# EAGLE design basecircuit (EAGLE 6.2)
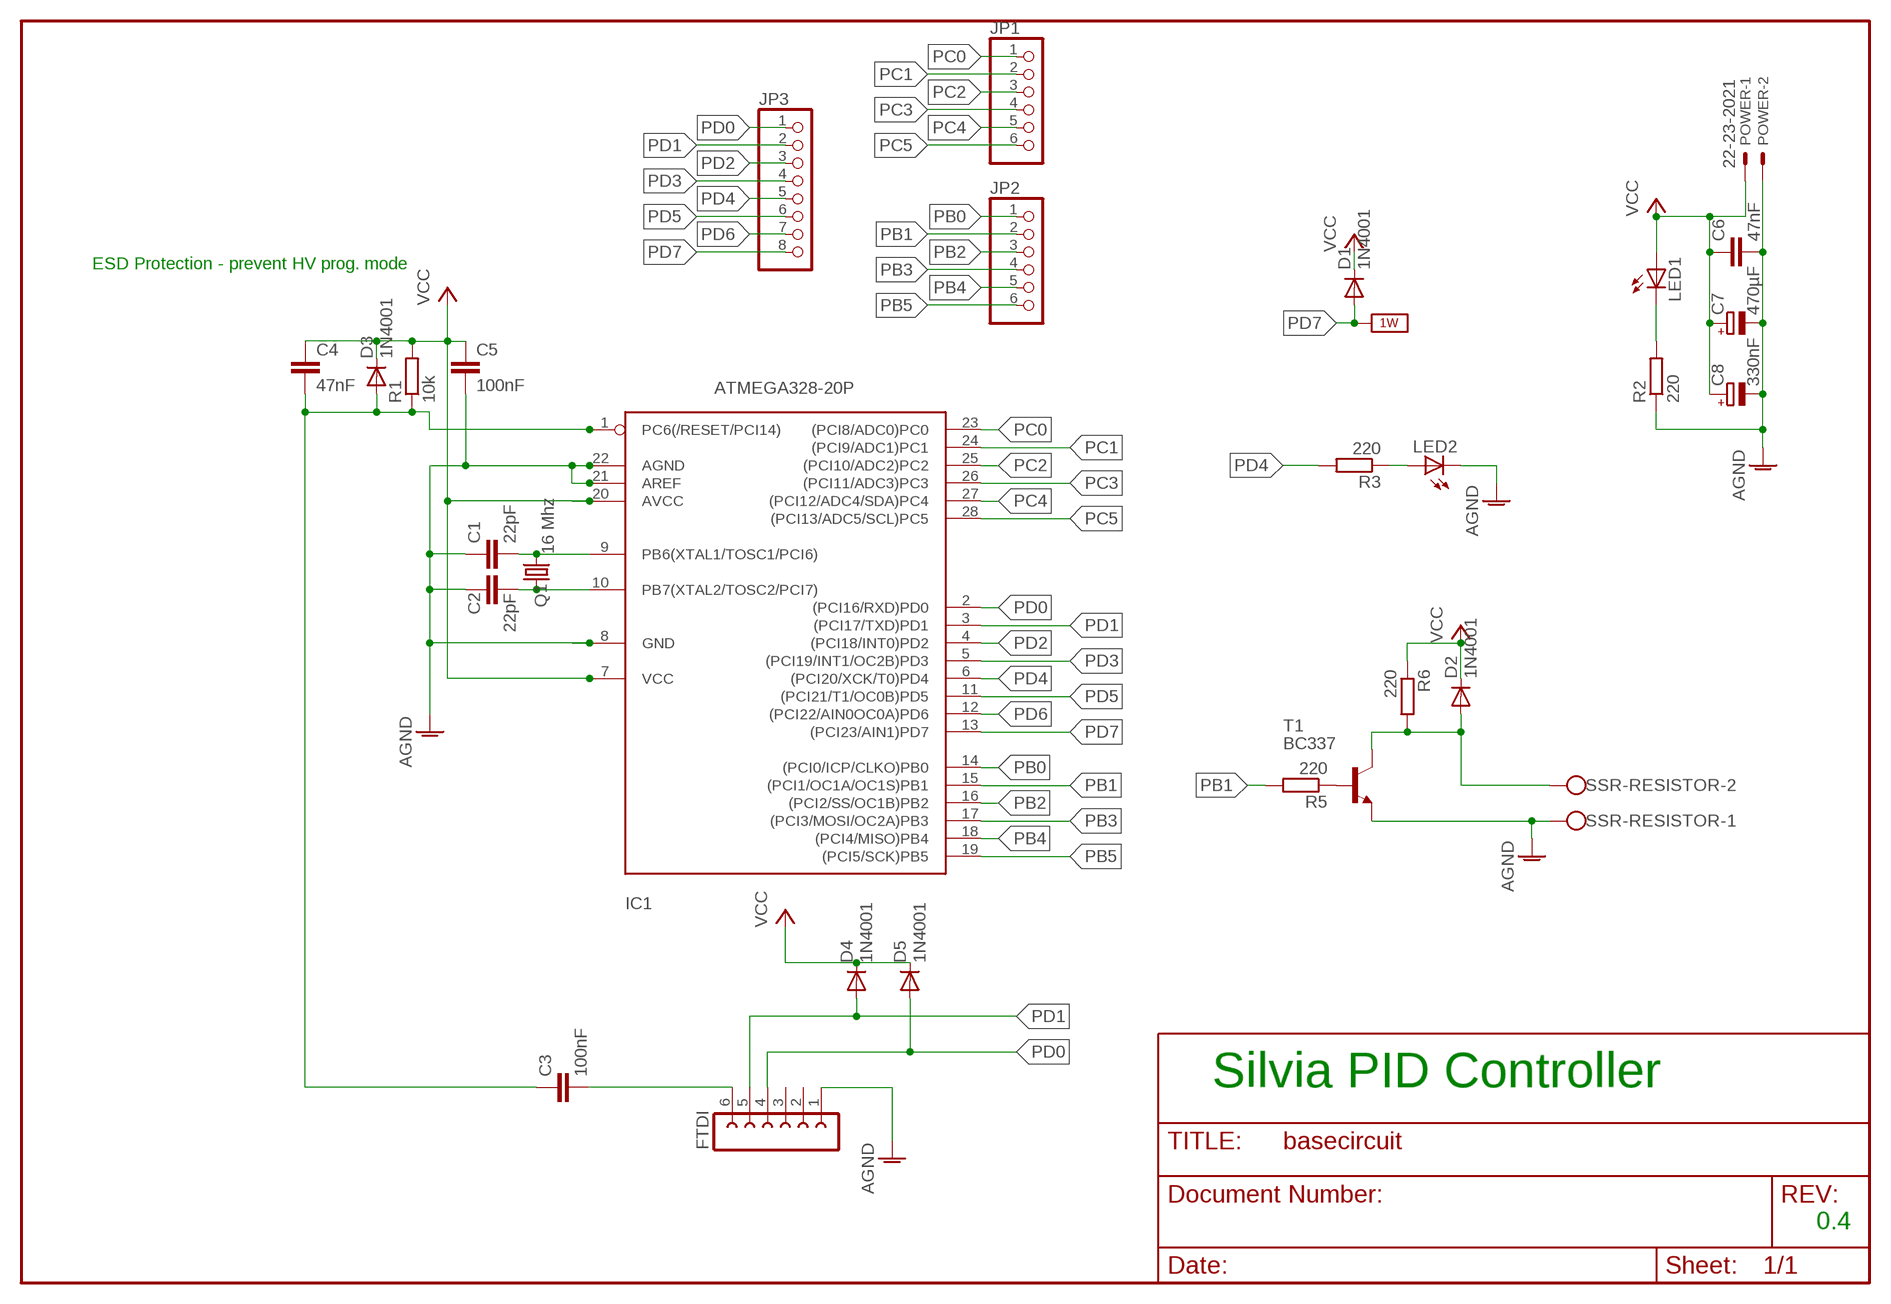
[diagram p0: schematic, sheet 1]

## Parts
C1  22pF  C-EU025-030X050  [C025-030X050]
C2  22pF  C-EU025-030X050  [C025-030X050]
C3  100nF  C-EU025-030X050  [C025-030X050]
C4  47nF  C-EU025-030X050  [C025-030X050]
C5  100nF  C-EU025-025X050  [C025-025X050]
C6  47nF  C-EU025-030X050  [C025-030X050]
C7  470µF  CPOL-EUE2,5-6E  [E2,5-6E]
C8  330nF  CPOL-EUE2,5-6E  [E2,5-6E]
D1  1N4001  1N4004  [DO41-10]
D2  1N4001  1N4004  [DO41-10]
D3  1N4001  1N4004  [DO41-10]
D4  1N4001  1N4004  [DO41-10]
D5  1N4001  1N4004  [DO41-10]
FTDI  FE06-1  [FE06]
IC1  ATMEGA328-20P  ATMEGA168-20P  [DIL28-3]
JP1  PINHD-1X6  [1X06]
JP2  PINHD-1X6  [1X06]
JP3  PINHD-1X8  [1X08]
LED1  LED5MM  [LED5MM]
LED2  LED5MM  [LED5MM]
POWER  22-23-2021  [22-23-2021]
Q1  16 Mhz  CRYSTALHC49U-V  [HC49U-V]
R1  10k  R-EU_0204/7  [0204/7]
R2  220  R-EU_0204/7  [0204/7]
R3  220  R-EU_0204/7  [0204/7]
R5  220  R-EU_0204/7  [0204/7]
R6  220  R-EU_0204/7  [0204/7]
SSR-RESISTOR  W237-102  [W237-102]
T1  BC337  [TO92]

## Nets
AGND: C1.1 C2.1 C5.2 C6.2 C7.- C8.- FTDI.1 IC1.8(GND) IC1.21(AREF) IC1.22(AGND) LED2.K(C) POWER.2 R2.1 SSR-RESISTOR.1 T1.1(E)
N$1: R5.1 T1.2(B)
N$2: LED1.K(C) R2.2
N$3: C3.2 FTDI.6
N$6: LED2.A R3.1
N$9: C1.2 IC1.9(PB6(XTAL1/TOSC1/PCI6)) Q1.2
N$10: C2.2 IC1.10(PB7(XTAL2/TOSC2/PCI7)) Q1.1
N$11: C3.1 C4.2 D3.A IC1.1(PC6(/RESET/PCI14)) R1.1
N$14: D2.A R6.2 SSR-RESISTOR.2 T1.3(C)
PB0: IC1.14((PCI0/ICP/CLKO)PB0) JP2.1
PB1: IC1.15((PCI1/OC1A/OC1S)PB1) JP2.2 R5.2
PB2: IC1.16((PCI2/SS/OC1B)PB2) JP2.3
PB3: IC1.17((PCI3/MOSI/OC2A)PB3) JP2.4
PB4: IC1.18((PCI4/MISO)PB4) JP2.5
PB5: IC1.19((PCI5/SCK)PB5) JP2.6
PC0: IC1.23((PCI8/ADC0)PC0) JP1.1
PC1: IC1.24((PCI9/ADC1)PC1) JP1.2
PC2: IC1.25((PCI10/ADC2)PC2) JP1.3
PC3: IC1.26((PCI11/ADC3)PC3) JP1.4
PC4: IC1.27((PCI12/ADC4/SDA)PC4) JP1.5
PC5: IC1.28((PCI13/ADC5/SCL)PC5) JP1.6
PD0: D5.A FTDI.4 IC1.2((PCI16/RXD)PD0) JP3.1
PD1: D4.A FTDI.5 IC1.3((PCI17/TXD)PD1) JP3.2
PD2: IC1.4((PCI18/INT0)PD2) JP3.3
PD3: IC1.5((PCI19/INT1/OC2B)PD3) JP3.4
PD4: IC1.6((PCI20/XCK/T0)PD4) JP3.5 R3.2
PD5: IC1.11((PCI21/T1/OC0B)PD5) JP3.6
PD6: IC1.12((PCI22/AIN0OC0A)PD6) JP3.7
PD7: D1.A IC1.13((PCI23/AIN1)PD7) JP3.8 ; supply symbol labelled 1W_SUP
VCC: C4.1 C5.1 C6.1 C7.+ C8.+ D1.C D2.C D3.C D4.C D5.C IC1.7(VCC) IC1.20(AVCC) LED1.A POWER.1 R1.2 R6.1
Unconnected: FTDI.2 FTDI.3

## Notes on the sheet
- ESD Protection - prevent HV prog. mode
- Silvia PID Controller
- 0.4

## Library data of the parts
C1-C6 = rcl:C-EU: CAPACITOR, European symbol
C7 C8 = rcl:CPOL-EU: POLARIZED CAPACITOR, European symbol
D1-D5 = diode:1N4004: DIODE general purpose rectifier, 1 A
FTDI = con-lsta:FE06-1: FEMALE HEADER
IC1 = avr:ATMEGA168*P: MICROCONTROLLER 16 kBytes FLASH 1 kBytes SRAM 512 Bytes EEPROM USART 8-channel 10 bit ADC
JP1 JP2 = pinhead:PINHD-1X6: PIN HEADER
JP3 = pinhead:PINHD-1X8: PIN HEADER
LED1 LED2 = led:LED: LED OSRAM: - CHIPLED LG R971, LG N971, LY N971, LG Q971, LY Q971, LO R971, LY R971 LH N974, LH R974 LS Q976, LO Q976, LY Q976 LO Q996 - Hyper CHIPLED LW Q18S LB Q993, LB Q99A, LB R99A - SideLED LS A670, LO A670, LY A670, LG A670, LP A670 LB A673, LV A673, LT A673, LW A673 LH A674 LY A675 LS A676, LA A676, LO A676, LY A676, LW A676 LS A679, LY A679, LG A679 - Hyper Micro SIDELED® LS Y876, LA Y876, LO Y876, LY Y876 LT Y87S - SmartLED LW L88C, LW L88S LB L89C, LB L89S, LG L890 LS L89K, LO L89K, LY L89K LS L896, LA L896, LO L896, LY L896 - TOPLED LS T670, LO T670, LY T670, LG T670, LP T670 LSG T670, LSP T670, LSY T670, LOP T670, LYG T670 LG T671, LOG T671, LSG T671 LB T673, LV T673, LT T673, LW T673 LH T674 LS T676, LA T676, LO T676, LY T676, LB T676, LH T676, LSB T676, LW T676 LB T67C, LV T67C, LT T67C, LS T67K, LO T67K, LY T67K, LW E67C LS E67B, LA E67B, LO E67B, LY E67B, LB E67C, LV E67C, LT E67C LW T67C LS T679, LY T679, LG T679 LS T770, LO T770, LY T770, LG T770, LP T770 LB T773, LV T773, LT T773, LW T773 LH T774 LS E675, LA E675, LY E675, LS T675 LS T776, LA T776, LO T776, LY T776, LB T776 LHGB T686 LT T68C, LB T68C - Hyper Mini TOPLED® LB M676 - Mini TOPLED Santana® LG M470 LS M47K, LO M47K, LY M47K Source: http://www.osram.convergy.de LUXEON: - LUMILED® LXK2-PW12-R00, LXK2-PW12-S00, LXK2-PW14-U00, LXK2-PW14-V00 LXK2-PM12-R00, LXK2-PM12-S00, LXK2-PM14-U00 LXK2-PE12-Q00, LXK2-PE12-R00, LXK2-PE12-S00, LXK2-PE14-T00, LXK2-PE14-U00 LXK2-PB12-K00, LXK2-PB12-L00, LXK2-PB12-M00, LXK2-PB14-N00, LXK2-PB14-P00, LXK2-PB14-Q00 LXK2-PR12-L00, LXK2-PR12-M00, LXK2-PR14-Q00, LXK2-PR14-R00 LXK2-PD12-Q00, LXK2-PD12-R00, LXK2-PD12-S00 LXK2-PH12-R00, LXK2-PH12-S00 LXK2-PL12-P00, LXK2-PL12-Q00, LXK2-PL12-R00 Source: www.luxeon.com KINGBRIGHT: KA-3528ASYC Source: www.kingbright.com
POWER = con-molex:22-23-2021: .100" (2.54mm) Center Header - 2 Pin
Q1 = crystal:CRYSTAL: CRYSTAL
R1-R3 R5 R6 = rcl:R-EU_: RESISTOR, European symbol
SSR-RESISTOR = con-wago-500:W237-102: WAGO SCREW CLAMP
T1 = transistor:BC337: NPN TRANSISTOR

## Board
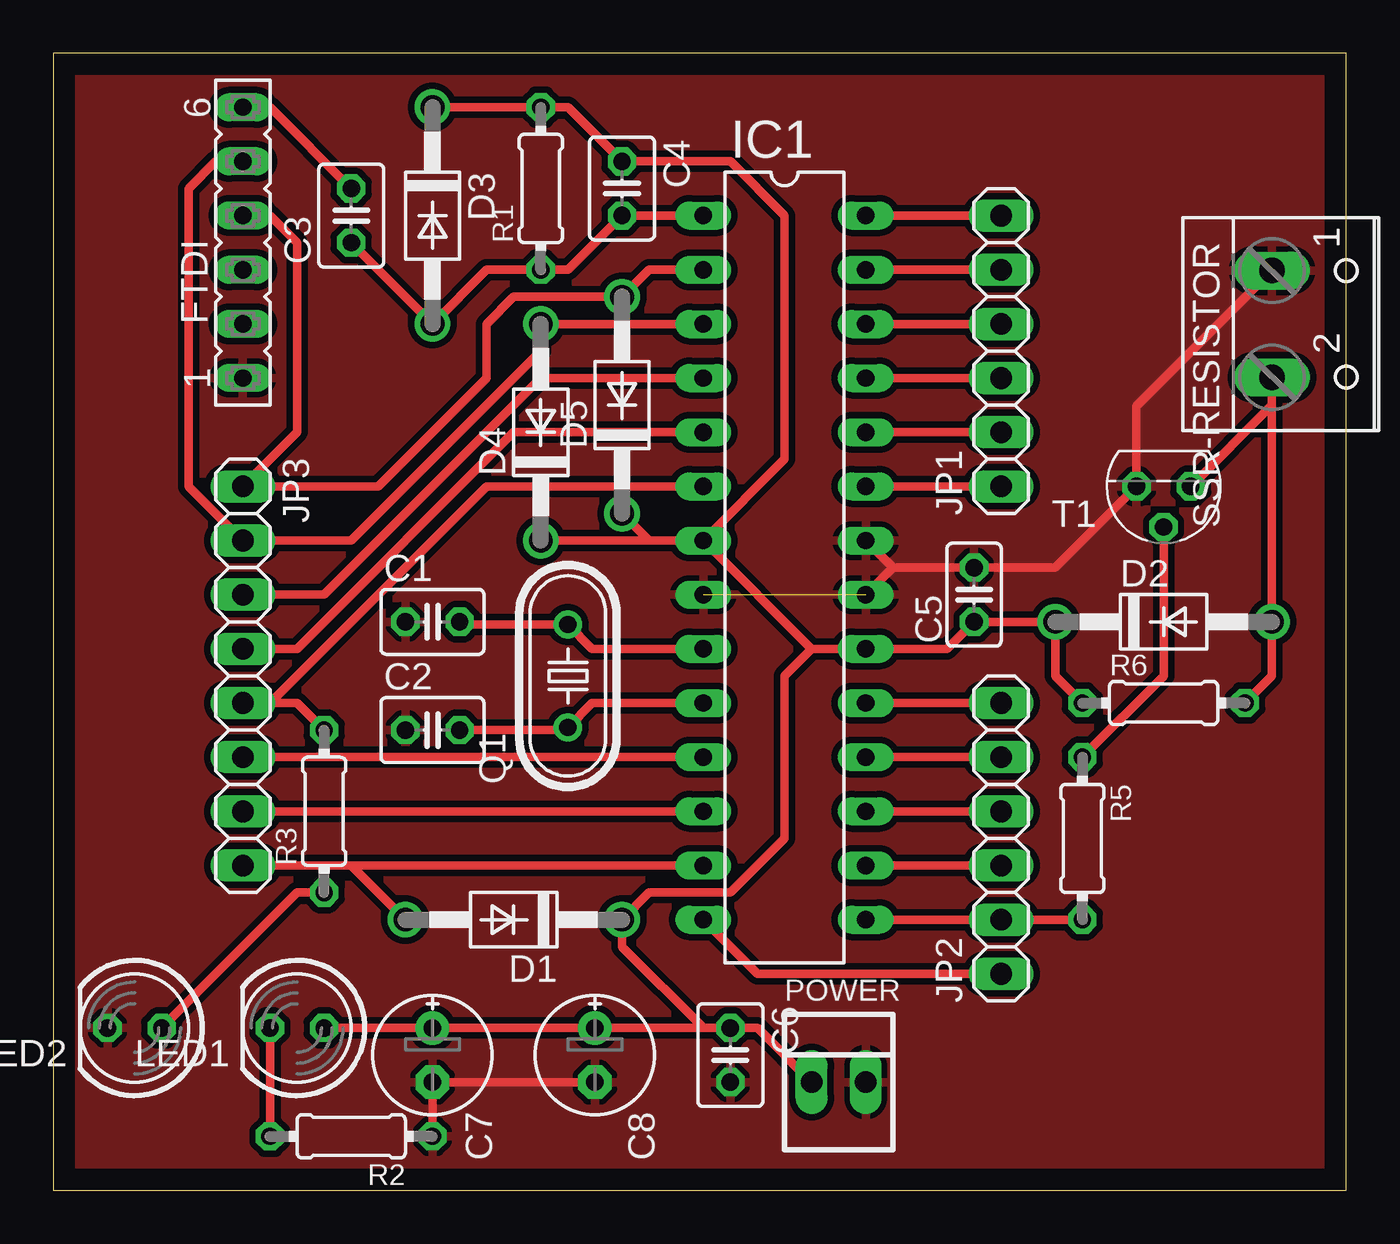
[diagram p1: board, top side]

Size 60.63 x 53.33 mm. Coordinates in mm from the lower left corner, seen from the top.
Outline: 0,0 60.63,0 60.63,53.33 0,53.33 0,0
Copper layers (1*16): Top 0.035mm / dielectric 1.5mm / Bottom 0.035mm
Design rules: minimum track width 10mil, minimum drill 24mil, track to track 8mil, track to pad 8mil, pad to pad 8mil, via to via 8mil, smd to smd 8mil, copper to edge 40mil, drill to drill 8mil, minimum pad ring 10mil, minimum via ring 8mil, stop-mask expansion 4mil, vias tented up to drill 0mil, thermal gap 10mil

### Footprints (pad centres in the part's own frame; a part is rotated, then mirrored left to right if it is on the bottom)
C025-030X050 = drill 0.813 octagon: 1 -1.27,0; 2 1.27,0
C025-025X050 = drill 0.813 octagon: 1 -1.27,0; 2 1.27,0
E2,5-6E = drill 0.813 pad 1.575: + -1.27,0 | drill 0.813 pad 1.575 octagon: - 1.27,0
DO41-10 = drill 1.118: A 5.08,0; C -5.08,0
FE06 = drill 0.813 long: 1 -6.35,0; 2 -3.81,0; 3 -1.27,0; 4 1.27,0; 5 3.81,0; 6 6.35,0
DIL28-3 = drill 0.813 long: 1 -16.51,-3.81; 2 -13.97,-3.81; 3 -11.43,-3.81; 4 -8.89,-3.81; 5 -6.35,-3.81; 6 -3.81,-3.81; 7 -1.27,-3.81; 8 1.27,-3.81; 9 3.81,-3.81; 10 6.35,-3.81; 11 8.89,-3.81; 12 11.43,-3.81; 13 13.97,-3.81; 14 16.51,-3.81; 15 16.51,3.81; 16 13.97,3.81; 17 11.43,3.81; 18 8.89,3.81; 19 6.35,3.81; 20 3.81,3.81; 21 1.27,3.81; 22 -1.27,3.81; 23 -3.81,3.81; 24 -6.35,3.81; 25 -8.89,3.81; 26 -11.43,3.81; 27 -13.97,3.81; 28 -16.51,3.81
1X06 = drill 1.016 long: 1 -6.35,0; 2 -3.81,0; 3 -1.27,0; 4 1.27,0; 5 3.81,0; 6 6.35,0
1X08 = drill 1.016 long: 1 -8.89,0; 2 -6.35,0; 3 -3.81,0; 4 -1.27,0; 5 1.27,0; 6 3.81,0; 7 6.35,0; 8 8.89,0
LED5MM = drill 0.813 octagon: A -1.27,0; K 1.27,0
22-23-2021 = drill 1 long: 1 -1.27,0; 2 1.27,0
HC49U-V = drill 0.813: 1 -2.413,0; 2 2.413,0
0204/7 = drill 0.813 octagon: 1 -3.81,0; 2 3.81,0
W237-102 = drill 1.194 long: 1 -2.5,-1.27; 2 2.5,-1.27
TO92 = drill 0.813 octagon: 1 1.27,0; 2 0,1.905; 3 -1.27,0

### Placement (x,y rotation side)
C1  17.78,26.67 0 top
C2  17.78,21.59 0 top
C3  13.97,45.72 90 top
C4  26.67,46.99 270 top
C5  43.18,27.94 90 top
C6  31.75,6.35 270 top
C7  17.78,6.35 270 top
C8  25.4,6.35 270 top
D1  21.59,12.7 180 top
D2  52.07,26.67 0 top
D3  17.78,45.72 270 top
D4  22.86,35.56 90 top
D5  26.67,36.83 90 top
FTDI  8.89,44.45 90 top
IC1  34.29,29.21 270 top
JP1  44.45,39.37 90 top
JP2  44.45,16.51 90 top
JP3  8.89,24.13 270 top
LED1  11.43,7.62 180 top
LED2  3.81,7.62 180 top
POWER  36.83,5.08 0 top
Q1  24.13,24.13 90 top
R1  22.86,46.99 90 top
R2  13.97,2.54 180 top
R3  12.7,17.78 90 top
R5  48.26,16.51 270 top
R6  52.07,22.86 0 top
SSR-RESISTOR  58.42,40.64 270 top
T1  52.07,33.02 180 top

### Tracks (layer width: path | path; a pad name or v marks a point on that pad's centre or on a via)
AGND  (1 unrouted)
  Top 0.406: IC1.21 39.37,29.21 | IC1.22 39.37,29.21 | 39.37,29.21 C5.2 46.99,29.21 T1.1 50.8,36.79 SSR-RESISTOR.1 | C8.- C7.- R2.1
  pour Top (isolate 0.305): 0,53.34 60.96,53.34 60.96,0 0,0
N$1
  Top 0.406: T1.2 52.07,24.13 R5.1
N$2
  Top 0.406: R2.2 LED1.K
N$3
  Top 0.406: FTDI.6 10.16,50.8 C3.2
N$6
  Top 0.406: R3.1 11.43,13.97 LED2.A
N$9
  Top 0.406: IC1.9 25.27,25.4 Q1.2 19.18,26.54 C1.2
N$10
  Top 0.406: C2.2 24,21.59 Q1.1 25.27,22.86 IC1.10
N$11
  Top 0.406: IC1.1 C4.2 24.13,43.18 R1.1 20.32,43.18 D3.A C3.1
N$14
  Top 0.406: R6.2 57.15,24.13 D2.A SSR-RESISTOR.2 57.15,36.83 T1.3
PB0
  Top 0.406: JP2.1 33.02,10.16 IC1.14
PB1
  Top 0.406: IC1.15 JP2.2 R5.2
PB2
  Top 0.406: JP2.3 IC1.16
PB3
  Top 0.406: IC1.17 JP2.4
PB4
  Top 0.406: JP2.5 IC1.18
PB5
  Top 0.406: IC1.19 JP2.6
PC0
  Top 0.406: IC1.23 JP1.1
PC1
  Top 0.406: JP1.2 IC1.24
PC2
  Top 0.406: IC1.25 JP1.3
PC3
  Top 0.406: JP1.4 IC1.26
PC4
  Top 0.406: JP1.5 IC1.27
PC5
  Top 0.406: JP1.6 IC1.28
PD0
  Top 0.406: IC1.2 27.94,43.18 D5.A 21.59,41.91 20.32,40.64 20.32,38.1 15.24,33.02 JP3.1 11.43,35.56 11.43,44.45 10.16,45.72 FTDI.4
PD1
  Top 0.406: IC1.3 D4.A 22.86,39.37 13.97,30.48 JP3.2 6.35,33.02 6.35,46.99 7.62,48.26 FTDI.5
PD2
  Top 0.406: JP3.3 12.7,27.94 22.86,38.1 IC1.4
PD3
  Top 0.406: JP3.4 11.43,25.4 21.59,35.56 IC1.5
PD4
  Top 0.406: IC1.6 20.32,33.02 10.16,22.86 JP3.5 11.43,22.86 R3.2
PD5
  Top 0.406: JP3.6 IC1.11
PD6
  Top 0.406: JP3.7 IC1.12
PD7
  Top 0.406: 13.97,15.24 JP3.8 10.16,15.24 | 13.97,15.24 IC1.13 | D1.A 13.97,15.24
VCC
  Top 0.406: R6.1 46.99,24.13 D2.C C5.1 41.91,25.4 IC1.20 35.56,25.4 | IC1.7 D4.C | IC1.7 35.56,25.4 | IC1.7 27.94,30.48 D5.C | 35.56,25.4 34.29,24.13 34.29,16.51 31.75,13.97 27.94,13.97 D1.C 26.67,11.43 30.48,7.62 C6.1 | IC1.7 34.29,34.29 34.29,45.72 31.75,48.26 C4.1 24.13,50.8 R1.2 D3.C | C6.1 C8.+ C7.+ LED1.A | C6.1 33.02,7.62 POWER.1